# Altium schematic sheet [04] - CONTROL.SchDoc: Desk Digital Clock
size A4; DrawnBy: Ramil Teregulov; Address1: http://github.com/teregulov; Address2: http://github.com/teregulov/Desk-Digital-Clock; DocumentNumber: DDC-4; Revision: 1R0; SheetNumber: 4; SheetTotal: 7
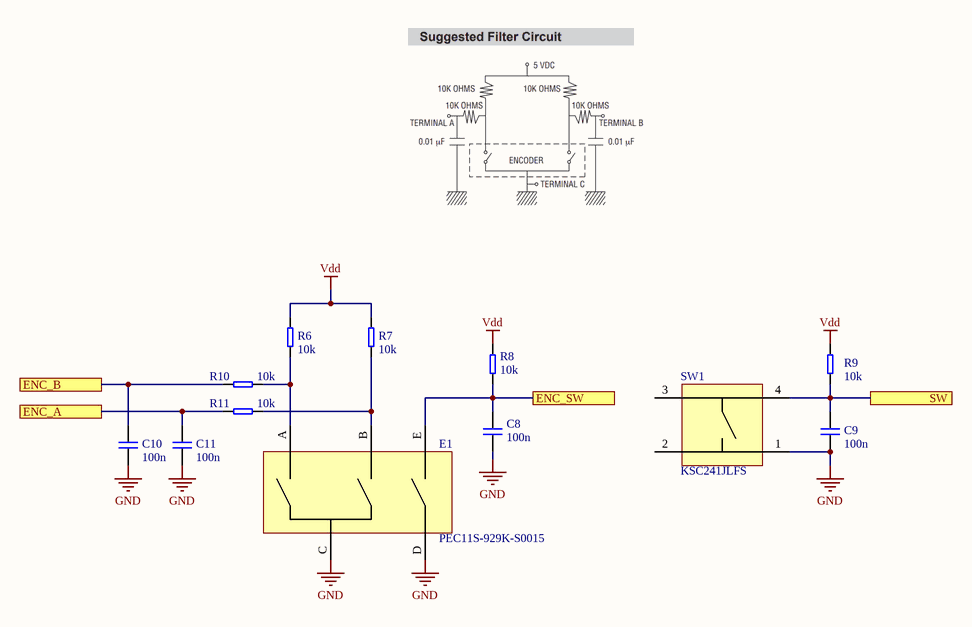
[diagram p0: [04] - CONTROL.SchDoc]

## Parts
C8  100n  [C0603]
C9  100n  [C0603]
C10  100n  [C0603]
C11  100n  [C0603]
E1  PEC11S-929K-S0015  [PEC11S-929K-S0015]
R6  10k  [R0603]
R7  10k  [R0603]
R8  10k  [R0603]
R9  10k  [R0603]
R10  10k  [R0603]
R11  10k  [R0603]
SW1  KSC241JLFS  [KSC241JLFS]

## Ports
ENC_A, ENC_B, ENC_SW, SW

## Nets
GND: C8.1 C9.1 C10.1 C11.1 E1.C E1.D SW1.1
Vdd: R6.2 R7.2 R8.2 R9.2
ENC_A: C11.2 R11.2 ; port ENC_A
ENC_B: C10.2 R10.2 ; port ENC_B
ENC_SW: C8.2 E1.E R8.1 ; port ENC_SW
SW: C9.2 R9.1 SW1.4 ; port SW
NetE1_A: E1.A R6.1 R10.1
NetE1_B: E1.B R7.1 R11.1

Not connected (* = marked no-connect by the designer): SW1 2 3

## Notes on the sheet
- Title:
- Size:
- Date:
- A4
- Number:
- Time:
- Revision:
- Sheet
- of
- File:

## Library data of the parts
C8-C11 = Cap: CAPACITOR; Value: 100n
E1 = PEC11S-929K-S0015: ROTARY ENCODER MECHANICAL 15PPR; Manufacturer: Bourns; P/N: PEC11S-929K-S0015; Datasheet: https://www.bourns.com/docs/product-datasheets/pec11s.pdf?sfvrsn=601089f1_5; Supplier 1: Aliexpress; Supplier Part Number 1: https://ru.aliexpress.com/item/32982414097.html?spm=a2g0o.productlist.0.0.66c8dd40JI3Wx0&algo_pvid=9a118981-c070-4602-89dc-e0076a1d9175&algo_expid=9a118981-c070-4602-89dc-e0076a1d9175-0&btsid=fce86d33-42b5-41e8-9f27-e9f4b1b87b22&ws_ab_test=searchweb0_0,searchweb201602_7,searchweb201603_52
R6-R11 = Res: RESISTOR; Value: 10k
SW1 = KSC241JLFS: SWITCH TACTILE SPST-NO 50mA @ 32VDC; Manufacturer: C&K; P/N: KSC241JLFS; Datasheet: https://www.ckswitches.com/media/1968/ksc2.pdf